# EAGLE design tick-tiny-mk-2.0 (EAGLE 6.5.0)
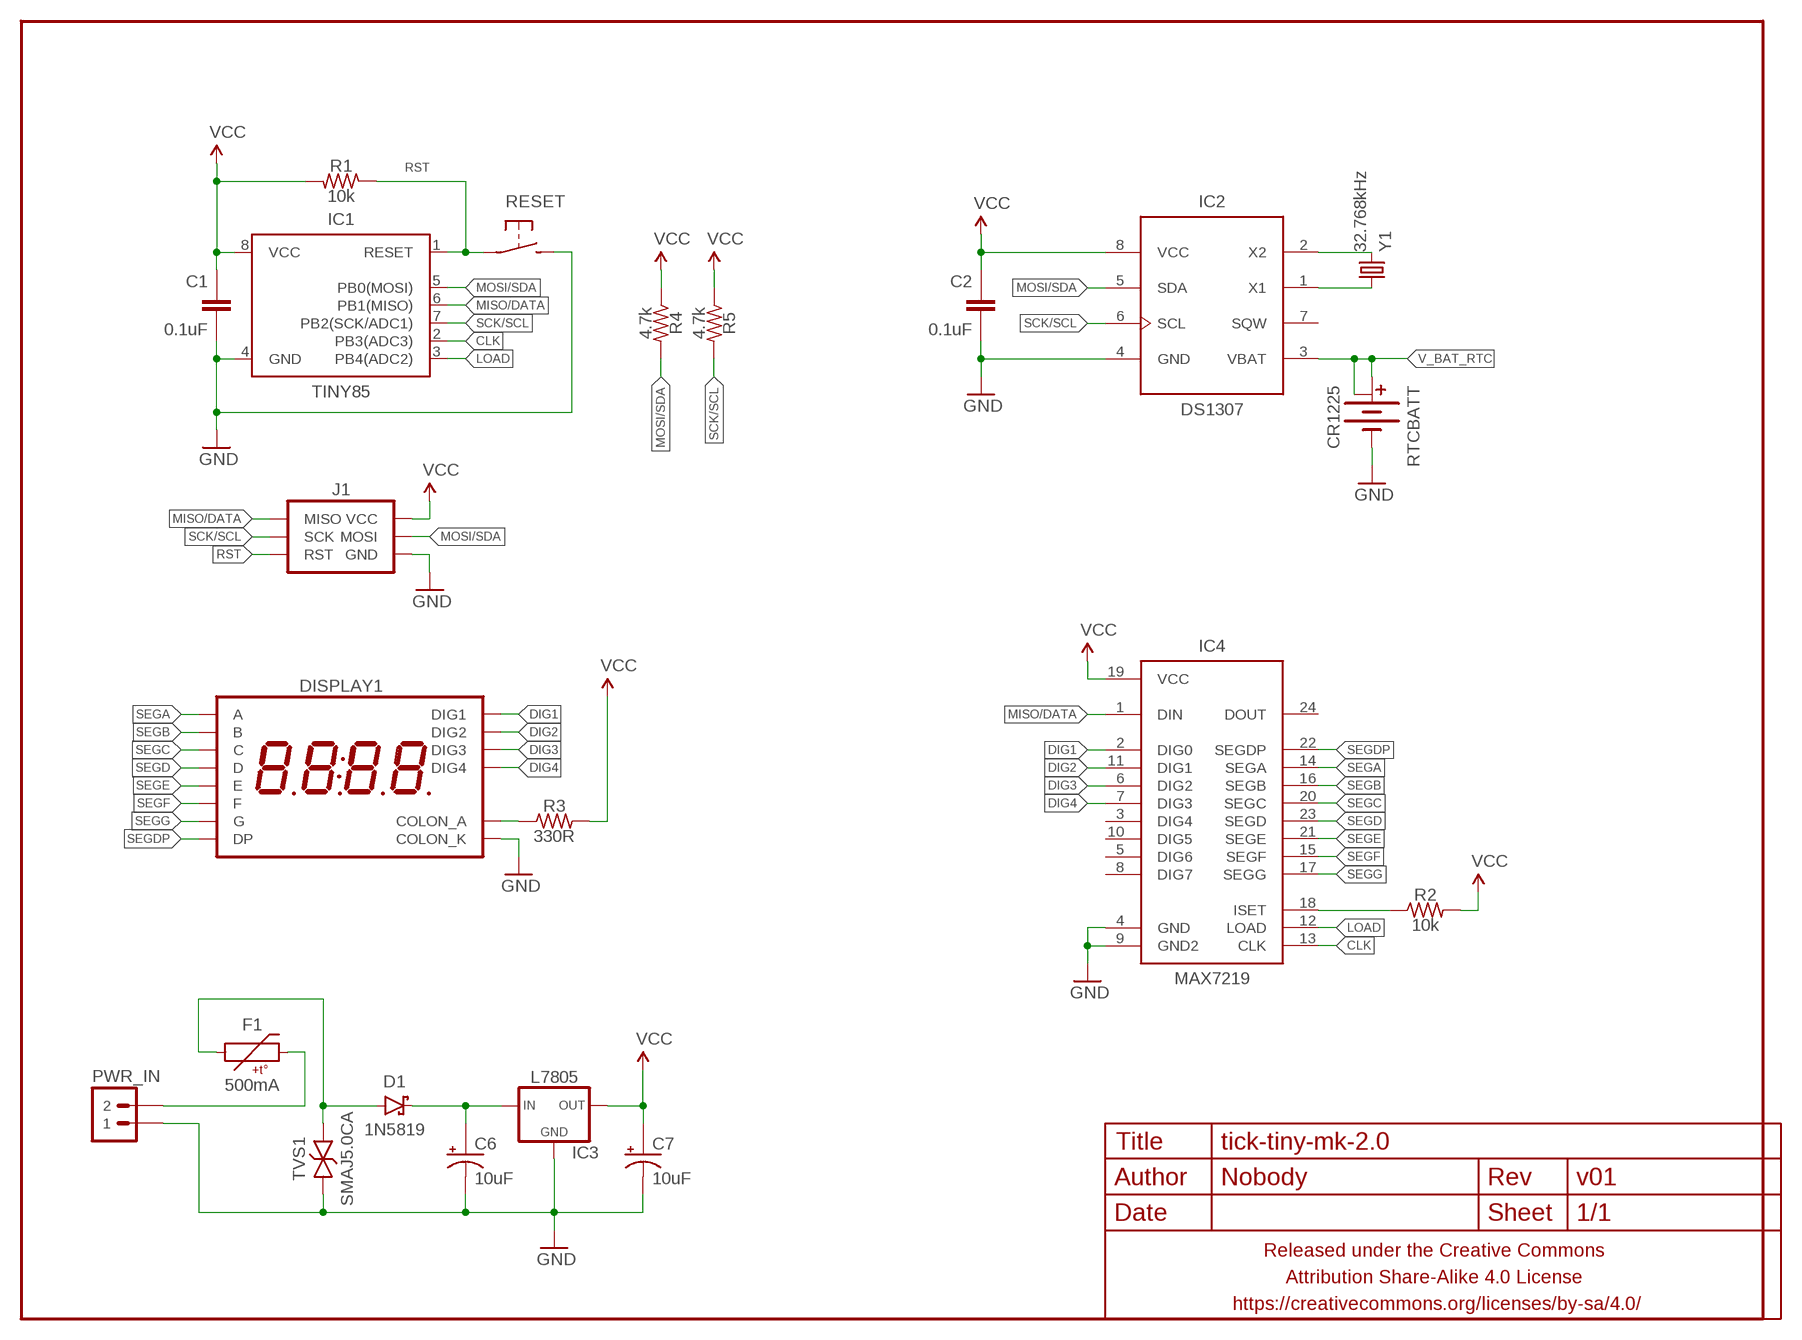
[diagram p0: schematic, sheet 1]

## Parts
C1  0.1uF  CAPACITOR-CERAMIC025-024X044  [C025-024X044]
C2  0.1uF  CAPACITOR-CERAMIC025-024X044  [C025-024X044]
C6  10uF  CAPACITOR-POLARIZEDE2-5  [E2-5]
C7  10uF  CAPACITOR-POLARIZEDE2-5  [E2-5]
D1  1N5819  DIODE-SCHOTTKYPTH-10.16MM  [DIODE-10.16MM]
DISPLAY1  7SEG_4DIGIT_COLON14.2MM-CC-NS  [7SEG_4DIG_NS]
F1  500mA  PTCPTH-5.08MM  [PTC-PTH-5.08MM]
FRAME1  FRAME-LETTERNO_PACKAGE  [DUMMY]
IC1  TINY85  ATTINY45TINY85-20-DIP  [DIP08]
IC2  DS1307  [DIL08]
IC3  L7805  V_REG_78XXTO-92-INLINE  [TO-92-AMMO]
IC4  MAX7219  MAX7219SOIC-W  [SO24W]
J1  AVR_SPI_PRG_6PTH  [2X3]
PWR_IN  M02JST-PTH-RA-R+  [JST-2-PH-RA-PTH-R+]
R1  10k  RESISTORPTH-AXIAL-7.62MM  [RESISTOR-AXIAL-PTH-7.62MM]
R2  10k  RESISTORPTH-AXIAL-5.08MM  [RESISTOR-AXIAL-PTH-5.08MM]
R3  330R  RESISTORPTH-AXIAL-5.08MM  [RESISTOR-AXIAL-PTH-5.08MM]
R4  4.7k  RESISTORPTH-AXIAL-7.62MM  [RESISTOR-AXIAL-PTH-7.62MM]
R5  4.7k  RESISTORPTH-AXIAL-7.62MM  [RESISTOR-AXIAL-PTH-7.62MM]
RESET  SPST-NO-TACT3MM-PTH-SMALL-PADS  [DTS-3-SMALL-PADS]
RTCBATT  CR1225  BATTERY-COINCR1225_SMD_SMALLER  [BATTCON_12MM_SMD]
TVS1  SMAJ5.0CA  TVSDO-41-10.16MM  [DO-41-TVS-BI-10.16MM]
Y1  32.768kHz  CRYSTALTC26H  [TC26H]

## Nets
CLK: IC1.2(PB3(ADC3)) IC4.13(CLK)
DIG1: DISPLAY1.P$14(DIG1) IC4.2(DIG0)
DIG2: DISPLAY1.P$11(DIG2) IC4.11(DIG1)
DIG3: DISPLAY1.P$10(DIG3) IC4.6(DIG2)
DIG4: DISPLAY1.P$6(DIG4) IC4.7(DIG3)
GND: C1.2 C2.2 C6.- C7.- DISPLAY1.P$7(COLON_K) IC1.4(GND) IC2.4(GND) IC3.2(GND) IC4.4(GND) IC4.9(GND2) J1.6(GND) PWR_IN.1 RESET.2 RTCBATT.- TVS1.P$1
LOAD: IC1.3(PB4(ADC2)) IC4.12(LOAD)
MISO/DATA: IC1.6(PB1(MISO)) IC4.1(DIN) J1.1(MISO)
MOSI/SDA: IC1.5(PB0(MOSI)) IC2.5(SDA) J1.4(MOSI) R4.P$2
N$1: IC2.2(X2) Y1.2
N$2: IC2.1(X1) Y1.1
N$3: D1.A F1.P$1 TVS1.P$2
N$4: IC4.18(ISET) R2.P$1
N$5: F1.P$2 PWR_IN.2
N$6: DISPLAY1.P$8(COLON_A) R3.P$1
N$8: C6.+ D1.C IC3.1(IN)
RST: IC1.1(RESET) J1.5(RST) R1.P$1 RESET.1
SCK/SCL: IC1.7(PB2(SCK/ADC1)) IC2.6(SCL) J1.3(SCK) R5.P$2
SEGA: DISPLAY1.P$13(A) IC4.14(SEGA)
SEGB: DISPLAY1.P$9(B) IC4.16(SEGB)
SEGC: DISPLAY1.P$4(C) IC4.20(SEGC)
SEGD: DISPLAY1.P$2(D) IC4.23(SEGD)
SEGDP: DISPLAY1.P$3(DP) IC4.22(SEGDP)
SEGE: DISPLAY1.P$1(E) IC4.21(SEGE)
SEGF: DISPLAY1.P$12(F) IC4.15(SEGF)
SEGG: DISPLAY1.P$5(G) IC4.17(SEGG)
V_BAT_RTC: IC2.3(VBAT) RTCBATT.+@1(+) RTCBATT.+@2(+1)
VCC: C1.1 C2.1 C7.+ IC1.8(VCC) IC2.8(VCC) IC3.3(OUT) IC4.19(VCC) J1.2(VCC) R1.P$2 R2.P$2 R3.P$2 R4.P$1 R5.P$1
Unconnected: IC2.7(SQW) IC4.3(DIG4) IC4.5(DIG6) IC4.8(DIG7) IC4.10(DIG5) IC4.24(DOUT)

## Library data of the parts
C1 C2 = A_butts:CAPACITOR-CERAMIC: CAPACITOR, European symbol
C6 C7 = A_butts:CAPACITOR-POLARIZED: POLARIZED CAPACITOR, American symbol
D1 = A_butts:DIODE-SCHOTTKY: Schottky diodes in SFE's production catalog BAT20J 1A 23V 0.62Vf RB751 120mA 40V 0.37Vf PMEG4005EJ 0.5A 40V 0.42Vf MBRA140 1A 40V 0.5Vf B340A 3A 40V SMA
DISPLAY1 = A_butts:7SEG_4DIGIT_COLON
F1 = A_butts:PTC: Resettable Fuse PTC Resettable Fuse. Spark Fun Electronics SKU : COM-08357
FRAME1 = A_butts:FRAME-LETTER: Schematic Frame Standard 8.5x11 US Letter frame; DESIGNER: Nobody; VERSION: v01
IC1 = A_butts:ATTINY45: Atmel 8-pin 2/4/8kB flash uC; PROD_ID: IC-09445; VALUE: TINY85-20-DIP
IC2 = A_butts:DS1307: DS1307 Real time clock (RTC) with battery backup ability. Talk to it via i2c
IC3 = A_butts:V_REG_78XX: Voltage Regulator Standard 7805 5V regulator. IGO (Input Ground Output). Spark Fun Electronics SKU : COM-00107
IC4 = A_butts:MAX7219: 8-digit, 8-segment LED display driver, serial input
J1 = A_butts:AVR_SPI_PRG_6: AVR ISP 6 Pin This is the reduced ISP connector for AVR programming. Common on Arduino. This footprint will take up less PCB space and can be used with a 10-pin to 6-pin adapter such as SKU: BOB-08508 **Special note about "TEST_POINT" package. The stop mask is on the top side, so if you want your programming test points to be on the bottom of your board, make sure to place this package on the bottom side of the board. This also ensure that the orientation to program from the bottom side will be correct.
PWR_IN = A_butts:M02: Standard 2-pin 0.1" header. Use with - straight break away headers ( PRT-00116) - right angle break away headers (PRT-00553) - swiss pins (PRT-00743) - machine pins (PRT-00117) - female headers (PRT-00115) Molex polarized connector foot print use with: PRT-08233 with associated crimp pins and housings. 2.54_SCREWTERM for use with PRT-10571. 3.5mm Screw Terminal footprints for PRT-08084 5mm Screw Terminal footprints for use with PRT-08433
R1-R5 = A_butts:RESISTOR: RESISTOR, American symbol
RESET = A_butts:SPST-NO-TACT
RTCBATT = A_butts:BATTERY-COIN
TVS1 = A_butts:TVS: Transient voltage suppressor- prevents ESD on inputs. Ignore package description- MBRA140 is NOT this type of part!!!
Y1 = A_butts:CRYSTAL: Various standard crystals. Proven footprints. Spark Fun Electronics SKU : COM-00534

## Board
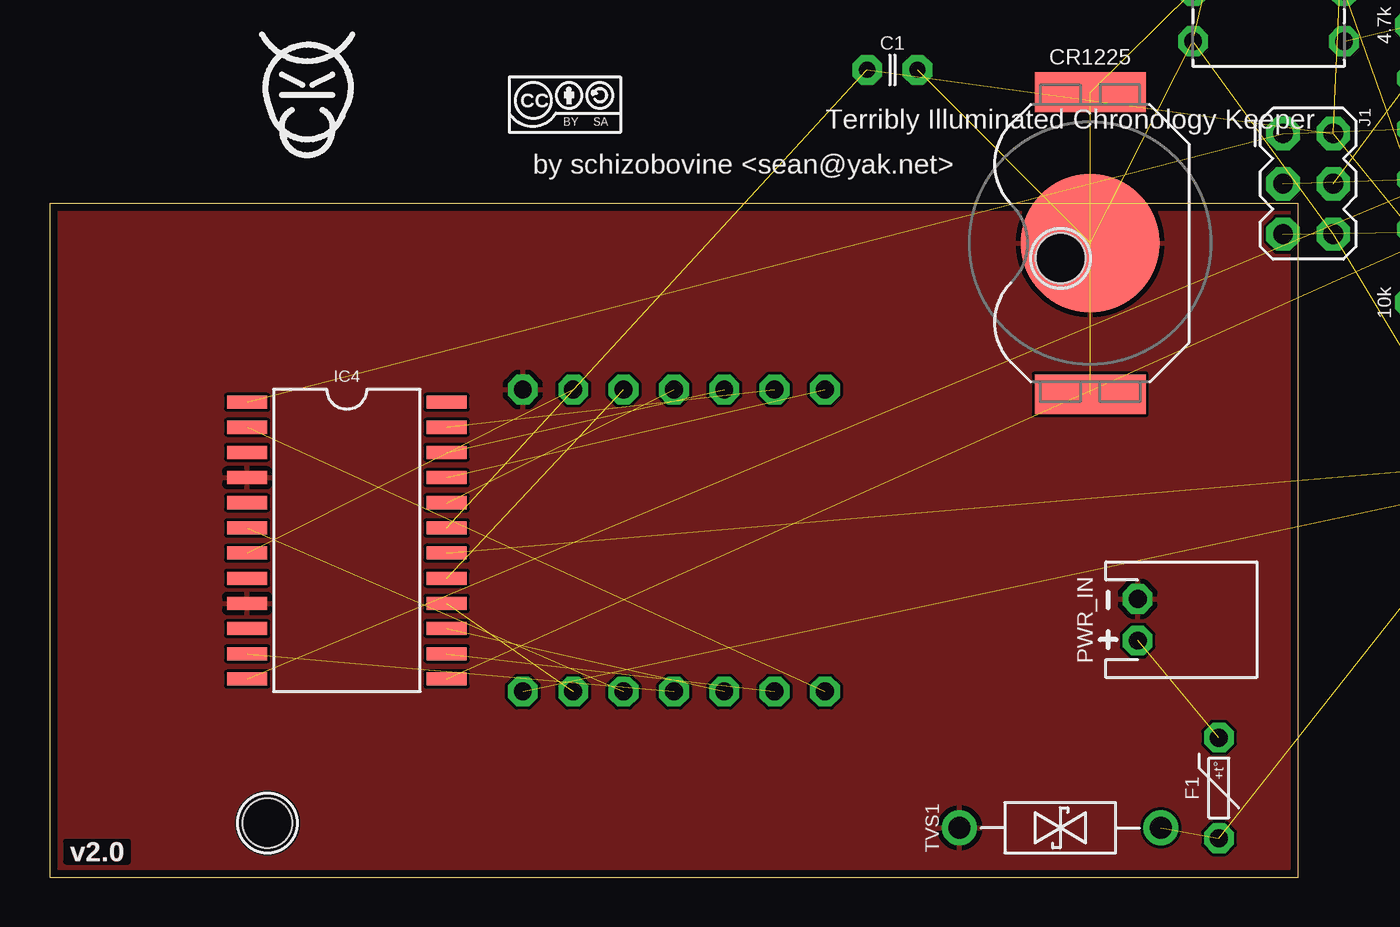
[diagram p1: board, top side]
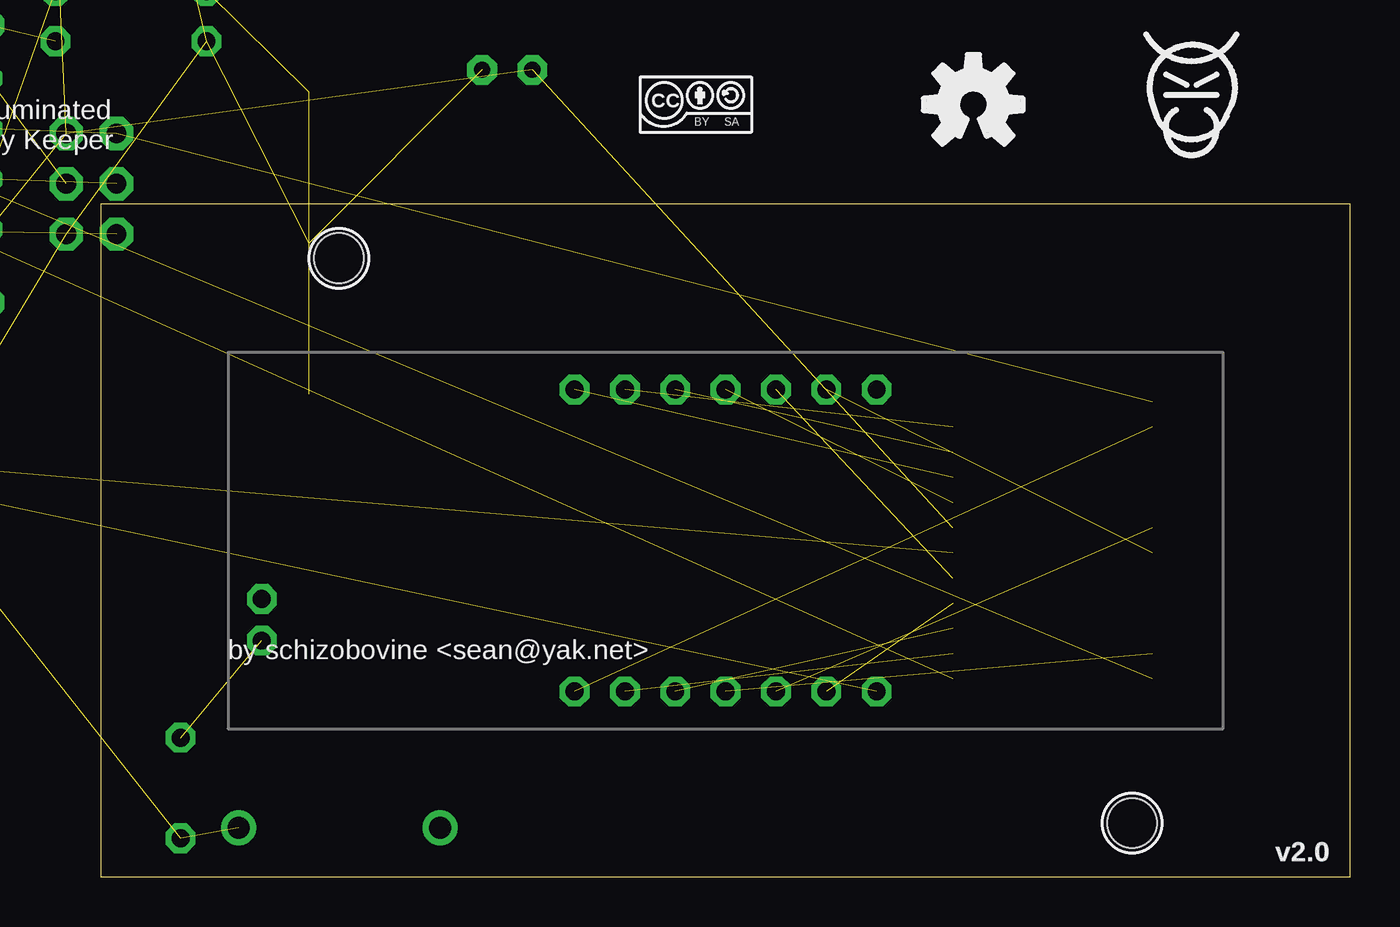
[diagram p2: board, bottom side, seen from below]

Size 63 x 34 mm. Coordinates in mm from the lower left corner, seen from the top.
Outline: 63,34 0,34 0,0 63,0 63,34
Copper layers (1*16): Top 0.0356mm / dielectric 1.5011mm / Bottom 0.0356mm
Design rules "LaenPCBOrder_2": minimum track width 6mil, minimum drill 13mil, track to track 6mil, track to pad 6mil, pad to pad 6mil, via to via 6mil, smd to smd 6mil, copper to edge 15mil, drill to drill 6mil, minimum pad ring 7mil, minimum via ring 7mil, stop-mask expansion 3mil, vias tented up to drill 20mil, thermal gap 10mil
Holes 2.5 mm at 51,31.25 11,2.75

### Footprints (pad centres in the part's own frame; a part is rotated, then mirrored left to right if it is on the bottom)
C025-024X044 = drill 0.813 pad 1.5 octagon: 1 -1.27,0; 2 1.27,0
E2-5 = drill 0.8 pad 1.4 octagon: + -1,0; - 1,0
DIODE-10.16MM = drill 1.1 pad 1.778: A -5.08,0; C 5.08,0
7SEG_4DIG_NS = drill 0.9 pad 1.5 octagon: P$1 -7.62,7.62; P$2 -5.08,7.62; P$3 -2.54,7.62; P$4 0,7.62; P$5 2.54,7.62; P$6 5.08,7.62; P$7 7.62,7.62; P$8 7.62,-7.62; P$9 5.08,-7.62; P$10 2.54,-7.62; P$11 0,-7.62; P$12 -2.54,-7.62; P$13 -5.08,-7.62; P$14 -7.62,-7.62
PTC-PTH-5.08MM = drill 0.9 pad 1.5 octagon: P$1 -2.54,0; P$2 2.54,0
DIP08 = drill 0.8 pad 1.4 octagon: 1 -3.81,-3.81; 2 -1.27,-3.81; 3 1.27,-3.81; 4 3.81,-3.81; 5 3.81,3.81; 6 1.27,3.81; 7 -1.27,3.81; 8 -3.81,3.81
DIL08 = drill 0.9 pad 1.5 octagon: 1 -3.81,-3.81; 2 -1.27,-3.81; 3 1.27,-3.81; 4 3.81,-3.81; 5 3.81,3.81; 6 1.27,3.81; 7 -1.27,3.81; 8 -3.81,3.81
TO-92-AMMO = drill 0.9 pad 1.5 octagon: 1 -2.54,0; 2 0,0; 3 2.54,0
SO24W = smd 0.66 x 2.032: 1 -6.985,-5.029; 2 -5.715,-5.029; 3 -4.445,-5.029; 4 -3.175,-5.029; 5 -1.905,-5.029; 6 -0.635,-5.029; 7 0.635,-5.029; 8 1.905,-5.029; 9 3.175,-5.029; 10 4.445,-5.029; 11 5.715,-5.029; 12 6.985,-5.029; 13 6.985,5.029; 14 5.715,5.029; 15 4.445,5.029; 16 3.175,5.029; 17 1.905,5.029; 18 0.635,5.029; 19 -0.635,5.029; 20 -1.905,5.029; 21 -3.175,5.029; 22 -4.445,5.029; 23 -5.715,5.029; 24 -6.985,5.029
2X3 = drill 1 pad 1.676 octagon: 1 -2.54,-1.27; 2 -2.54,1.27; 3 0,-1.27; 4 0,1.27; 5 2.54,-1.27; 6 2.54,1.27
JST-2-PH-RA-PTH-R+ = drill 0.9 pad 1.5 octagon: 1 -1.05,0; 2 1.05,0
RESISTOR-AXIAL-PTH-7.62MM = drill 0.9 pad 1.6 octagon: P$1 -3.81,0; P$2 3.81,0
RESISTOR-AXIAL-PTH-5.08MM = drill 0.9 pad 1.5 octagon: P$1 -2.54,0; P$2 2.54,0
DTS-3-SMALL-PADS = drill 1.3 pad 2: 1 -3.25,0; 2 3.25,0
BATTCON_12MM_SMD = smd 2 x 5.6: +@1 -7.62,0; +@2 7.62,0 | smd 7 x 7: - 0,0
DO-41-TVS-BI-10.16MM = drill 1.1 pad 1.778: P$1 -5.08,0; P$2 5.08,0
TC26H = drill 0.8 pad 1.27: 1 -1.27,0; 2 1.27,0

### Placement (x,y rotation side)
C1  42.52,40.75 0 top  (outside the outline)
C2  61.5,53 180 top  (outside the outline)
C6  81.75,51 0 top  (outside the outline)
C7  69.25,51 180 top  (outside the outline)
D1  90.99,49 180 top  (outside the outline)
DISPLAY1  31.5,17 0 bottom
F1  59,4.51 90 top
FRAME1  0,0 0 top
IC1  72.5,36.5 90 top  (outside the outline)
IC2  61.5,46 270 top  (outside the outline)
IC3  75.5,51 180 top  (outside the outline)
IC4  15,17 270 top
J1  63.5,35 270 top
PWR_IN  54.9,13 270 top
R1  72.5,29 180 top  (outside the outline)
R2  77,21 0 top  (outside the outline)
R3  81,21 0 top  (outside the outline)
R4  72.5,43 180 top  (outside the outline)
R5  72.5,46 180 top  (outside the outline)
RESET  72.5,25 180 top  (outside the outline)
RTCBATT  52.5,32 270 top
TVS1  50.99,2.5 0 top
U$1  [CC-BY-SA-4.0-NO-URL]  33,39 0 bottom  (outside the outline)
U$2  [COW_SMALL_METAL_NOTEXT]  13,40 0 top  (outside the outline)
U$3  [OSHWLOGO_TOP_0.2]  19,39 0 bottom  (outside the outline)
U$4  [COW_SMALL_METAL_NOTEXT]  8,40 0 bottom  (outside the outline)
U$5  [CC-BY-SA-4.0-NO-URL]  26,39 0 top  (outside the outline)
Y1  50.5,46 0 top  (outside the outline)

### Tracks (layer width: path | path; a pad name or v marks a point on that pad's centre or on a via)
CLK  (1 unrouted)
DIG1  (1 unrouted)
DIG2  (1 unrouted)
DIG3  (1 unrouted)
DIG4  (1 unrouted)
GND  (9 unrouted)
  pour Top: -0.1,34.1 63.1,34.1 63.1,-0.1 -0.1,-0.1
LOAD  (1 unrouted)
MISO/DATA  (2 unrouted)
MOSI/SDA  (3 unrouted)
N$1  (1 unrouted)
N$2  (1 unrouted)
N$3  (2 unrouted)
N$4  (1 unrouted)
N$5  (1 unrouted)
N$6  (1 unrouted)
N$8  (2 unrouted)
RST  (3 unrouted)
SCK/SCL  (3 unrouted)
SEGA  (1 unrouted)
SEGB  (1 unrouted)
SEGC  (1 unrouted)
SEGD  (1 unrouted)
SEGDP  (1 unrouted)
SEGE  (1 unrouted)
SEGF  (1 unrouted)
SEGG  (1 unrouted)
V_BAT_RTC  (2 unrouted)
VCC  (12 unrouted)

### Text on the board
tPlace: Terribly Illuminated Chronology Keeper | by schizobovine <sean@yak.net>
bPlace: Terribly Illuminated / Chronology Keeper | T.I.C.K | by schizobovine <sean@yak.net>